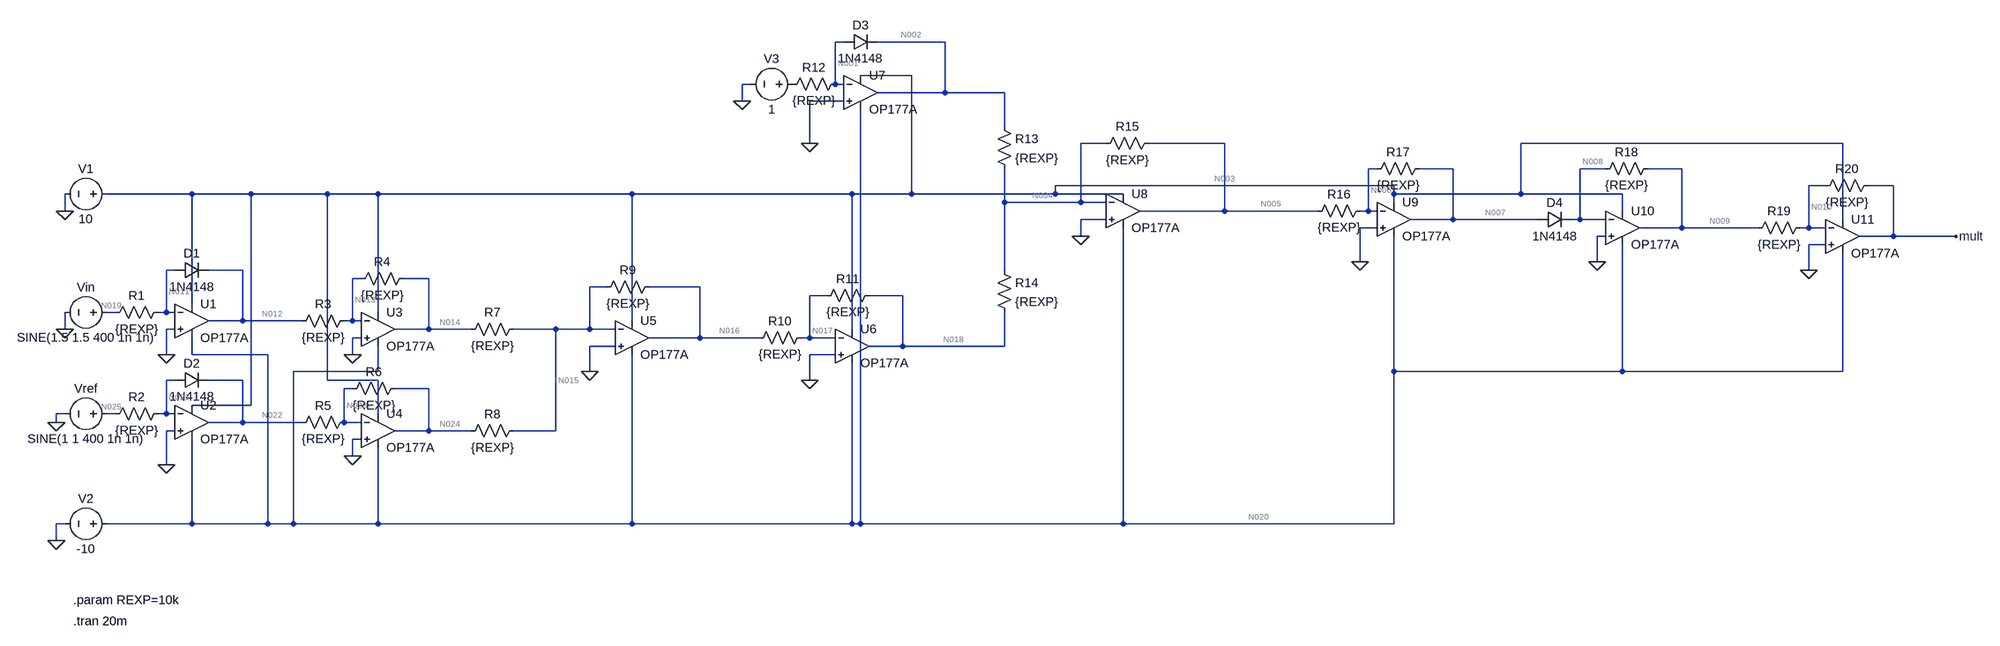
[diagram p0: schematic multiplier.asc]
multiplier.asc, the LTspice schematic file:
Version 4.1
SHEET 1 3688 712
WIRE 1504 -400 1488 -400
WIRE 1696 -400 1568 -400
WIRE 1632 -336 1536 -336
WIRE 1328 -320 1312 -320
WIRE 1488 -320 1488 -400
WIRE 1504 -320 1488 -320
WIRE 1696 -304 1696 -400
WIRE 1696 -304 1568 -304
WIRE 1808 -304 1696 -304
WIRE 1312 -288 1312 -320
WIRE 1504 -288 1440 -288
WIRE 1808 -240 1808 -304
WIRE 1440 -208 1440 -288
WIRE 2000 -208 1952 -208
WIRE 2224 -208 2080 -208
WIRE 3392 -208 2784 -208
WIRE 2512 -160 2496 -160
WIRE 2656 -160 2592 -160
WIRE 2944 -160 2896 -160
WIRE 3088 -160 3024 -160
WIRE 2544 -128 1904 -128
WIRE 3360 -128 3328 -128
WIRE 3488 -128 3440 -128
WIRE 272 -112 112 -112
WIRE 384 -112 272 -112
WIRE 528 -112 384 -112
WIRE 624 -112 528 -112
WIRE 1104 -112 624 -112
WIRE 1520 -112 1104 -112
WIRE 1632 -112 1632 -336
WIRE 1632 -112 1520 -112
WIRE 1904 -112 1904 -128
WIRE 1904 -112 1632 -112
WIRE 2032 -112 1904 -112
WIRE 2544 -112 2544 -128
WIRE 2784 -112 2784 -208
WIRE 2784 -112 2544 -112
WIRE 2976 -112 2784 -112
WIRE 1808 -96 1808 -160
WIRE 1952 -96 1952 -208
WIRE 1952 -96 1808 -96
WIRE 2000 -96 1952 -96
WIRE 2544 -96 2544 -112
WIRE 32 -80 32 -112
WIRE 2224 -80 2224 -208
WIRE 2224 -80 2064 -80
WIRE 2400 -80 2224 -80
WIRE 2496 -80 2496 -160
WIRE 2496 -80 2480 -80
WIRE 2512 -80 2496 -80
WIRE 2976 -80 2976 -112
WIRE 2000 -64 1952 -64
WIRE 2656 -64 2656 -160
WIRE 2656 -64 2576 -64
WIRE 2816 -64 2656 -64
WIRE 2896 -64 2896 -160
WIRE 2896 -64 2880 -64
WIRE 2944 -64 2896 -64
WIRE 3392 -64 3392 -208
WIRE 2512 -48 2480 -48
WIRE 3088 -48 3088 -160
WIRE 3088 -48 3008 -48
WIRE 3232 -48 3088 -48
WIRE 3328 -48 3328 -128
WIRE 3328 -48 3312 -48
WIRE 3360 -48 3328 -48
WIRE 1952 -32 1952 -64
WIRE 2944 -32 2928 -32
WIRE 3488 -32 3488 -128
WIRE 3488 -32 3424 -32
WIRE 3616 -32 3488 -32
WIRE 3360 -16 3328 -16
WIRE 2480 16 2480 -48
WIRE 2928 16 2928 -32
WIRE 240 32 224 32
WIRE 368 32 304 32
WIRE 1808 32 1808 -96
WIRE 3328 32 3328 -16
WIRE 592 48 576 48
WIRE 720 48 672 48
WIRE 1056 64 1024 64
WIRE 1232 64 1136 64
WIRE 1472 80 1440 80
WIRE 1616 80 1552 80
WIRE 272 96 272 -112
WIRE 128 112 112 112
WIRE 224 112 224 32
WIRE 224 112 208 112
WIRE 240 112 224 112
WIRE 624 112 624 -112
WIRE 368 128 368 32
WIRE 368 128 304 128
WIRE 480 128 368 128
WIRE 576 128 576 48
WIRE 576 128 560 128
WIRE 592 128 576 128
WIRE 1104 128 1104 -112
WIRE 32 144 32 112
WIRE 240 144 224 144
WIRE 720 144 720 48
WIRE 720 144 656 144
WIRE 800 144 720 144
WIRE 960 144 880 144
WIRE 1024 144 1024 64
WIRE 1024 144 960 144
WIRE 1072 144 1024 144
WIRE 1520 144 1520 -112
WIRE 592 160 576 160
WIRE 1232 160 1232 64
WIRE 1232 160 1136 160
WIRE 1344 160 1232 160
WIRE 1440 160 1440 80
WIRE 1440 160 1424 160
WIRE 1488 160 1440 160
WIRE 1072 176 1024 176
WIRE 1616 176 1616 80
WIRE 1616 176 1552 176
WIRE 1808 176 1808 112
WIRE 1808 176 1616 176
WIRE 224 192 224 144
WIRE 272 192 272 160
WIRE 416 192 272 192
WIRE 576 192 576 160
WIRE 1488 192 1440 192
WIRE 624 224 624 176
WIRE 624 224 464 224
WIRE 1024 224 1024 176
WIRE 2544 224 2544 -32
WIRE 2976 224 2976 -16
WIRE 2976 224 2544 224
WIRE 3392 224 3392 0
WIRE 3392 224 2976 224
WIRE 240 240 224 240
WIRE 368 240 304 240
WIRE 528 240 528 -112
WIRE 624 240 528 240
WIRE 1440 240 1440 192
WIRE 576 256 560 256
WIRE 720 256 656 256
WIRE 384 288 384 -112
WIRE 384 288 272 288
WIRE 32 304 16 304
WIRE 128 304 112 304
WIRE 224 304 224 240
WIRE 224 304 208 304
WIRE 240 304 224 304
WIRE 624 304 624 240
WIRE 16 320 16 304
WIRE 368 320 368 240
WIRE 368 320 304 320
WIRE 480 320 368 320
WIRE 560 320 560 256
WIRE 592 320 560 320
WIRE 240 336 224 336
WIRE 720 336 720 256
WIRE 720 336 656 336
WIRE 800 336 720 336
WIRE 960 336 960 144
WIRE 960 336 880 336
WIRE 592 352 576 352
WIRE 576 384 576 352
WIRE 224 400 224 336
WIRE 32 512 16 512
WIRE 272 512 272 352
WIRE 272 512 112 512
WIRE 416 512 416 192
WIRE 416 512 272 512
WIRE 464 512 464 224
WIRE 464 512 416 512
WIRE 624 512 624 368
WIRE 624 512 464 512
WIRE 1104 512 1104 192
WIRE 1104 512 624 512
WIRE 1520 512 1520 208
WIRE 1520 512 1104 512
WIRE 1536 512 1536 -272
WIRE 1536 512 1520 512
WIRE 2032 512 2032 -48
WIRE 2032 512 1536 512
WIRE 2544 512 2544 224
WIRE 2544 512 2032 512
WIRE 16 544 16 512
FLAG 32 144 0
FLAG 224 192 0
FLAG 16 320 0
FLAG 224 400 0
FLAG 576 192 0
FLAG 576 384 0
FLAG 32 -80 0
FLAG 16 544 0
FLAG 1024 224 0
FLAG 1440 240 0
FLAG 1312 -288 0
FLAG 1440 -208 0
FLAG 1952 -32 0
FLAG 2480 16 0
FLAG 2928 16 0
FLAG 3328 32 0
FLAG 3616 -32 mult
SYMBOL voltage 128 112 R90
WINDOW 0 -32 56 VBottom 2
WINDOW 3 32 56 VTop 2
WINDOW 123 0 0 Left 0
WINDOW 39 0 0 Left 0
SYMATTR InstName Vin
SYMATTR Value SINE(1.5 1.5 400 1n 1n)
SYMBOL OpAmps\\OP177A 272 64 R0
SYMATTR InstName U1
SYMBOL res 224 96 R90
WINDOW 0 0 56 VBottom 2
WINDOW 3 32 56 VTop 2
SYMATTR InstName R1
SYMATTR Value {REXP}
SYMBOL diode 240 48 R270
WINDOW 0 32 32 VTop 2
WINDOW 3 0 32 VBottom 2
SYMATTR InstName D1
SYMATTR Value 1N4148
SYMBOL OpAmps\\OP177A 272 256 R0
SYMATTR InstName U2
SYMBOL voltage 128 304 R90
WINDOW 0 -32 56 VBottom 2
WINDOW 3 32 56 VTop 2
WINDOW 123 0 0 Left 0
WINDOW 39 0 0 Left 0
SYMATTR InstName Vref
SYMATTR Value SINE(1 1 400 1n 1n)
SYMBOL res 224 288 R90
WINDOW 0 0 56 VBottom 2
WINDOW 3 32 56 VTop 2
SYMATTR InstName R2
SYMATTR Value {REXP}
SYMBOL diode 240 256 R270
WINDOW 0 32 32 VTop 2
WINDOW 3 0 32 VBottom 2
SYMATTR InstName D2
SYMATTR Value 1N4148
SYMBOL OpAmps\\OP177A 624 80 R0
SYMATTR InstName U3
SYMBOL res 576 112 R90
WINDOW 0 0 56 VBottom 2
WINDOW 3 32 56 VTop 2
SYMATTR InstName R3
SYMATTR Value {REXP}
SYMBOL res 688 32 R90
WINDOW 0 0 56 VBottom 2
WINDOW 3 32 56 VTop 2
SYMATTR InstName R4
SYMATTR Value {REXP}
SYMBOL OpAmps\\OP177A 624 272 R0
SYMATTR InstName U4
SYMBOL res 576 304 R90
WINDOW 0 0 56 VBottom 2
WINDOW 3 32 56 VTop 2
SYMATTR InstName R5
SYMATTR Value {REXP}
SYMBOL res 672 240 R90
WINDOW 0 0 56 VBottom 2
WINDOW 3 32 56 VTop 2
SYMATTR InstName R6
SYMATTR Value {REXP}
SYMBOL voltage 128 -112 R90
WINDOW 0 -32 56 VBottom 2
WINDOW 3 32 56 VTop 2
WINDOW 123 0 0 Left 0
WINDOW 39 0 0 Left 0
SYMATTR InstName V1
SYMATTR Value 10
SYMBOL voltage 128 512 R90
WINDOW 0 -32 56 VBottom 2
WINDOW 3 32 56 VTop 2
WINDOW 123 0 0 Left 0
WINDOW 39 0 0 Left 0
SYMATTR InstName V2
SYMATTR Value -10
SYMBOL res 896 128 R90
WINDOW 0 0 56 VBottom 2
WINDOW 3 32 56 VTop 2
SYMATTR InstName R7
SYMATTR Value {REXP}
SYMBOL res 896 320 R90
WINDOW 0 0 56 VBottom 2
WINDOW 3 32 56 VTop 2
SYMATTR InstName R8
SYMATTR Value {REXP}
SYMBOL OpAmps\\OP177A 1104 96 R0
SYMATTR InstName U5
SYMBOL res 1152 48 R90
WINDOW 0 0 56 VBottom 2
WINDOW 3 32 56 VTop 2
SYMATTR InstName R9
SYMATTR Value {REXP}
SYMBOL res 1440 144 R90
WINDOW 0 0 56 VBottom 2
WINDOW 3 32 56 VTop 2
SYMATTR InstName R10
SYMATTR Value {REXP}
SYMBOL OpAmps\\OP177A 1520 112 R0
SYMATTR InstName U6
SYMBOL res 1568 64 R90
WINDOW 0 0 56 VBottom 2
WINDOW 3 32 56 VTop 2
SYMATTR InstName R11
SYMATTR Value {REXP}
SYMBOL OpAmps\\OP177A 1536 -368 R0
SYMATTR InstName U7
SYMBOL voltage 1424 -320 R90
WINDOW 0 -32 56 VBottom 2
WINDOW 3 32 56 VTop 2
WINDOW 123 0 0 Left 0
WINDOW 39 0 0 Left 0
SYMATTR InstName V3
SYMATTR Value 1
SYMBOL res 1504 -336 R90
WINDOW 0 0 56 VBottom 2
WINDOW 3 32 56 VTop 2
SYMATTR InstName R12
SYMATTR Value {REXP}
SYMBOL diode 1504 -384 R270
WINDOW 0 32 32 VTop 2
WINDOW 3 0 32 VBottom 2
SYMATTR InstName D3
SYMATTR Value 1N4148
SYMBOL OpAmps\\OP177A 2032 -144 R0
SYMATTR InstName U8
SYMBOL res 1792 -256 R0
SYMATTR InstName R13
SYMATTR Value {REXP}
SYMBOL res 1792 16 R0
SYMATTR InstName R14
SYMATTR Value {REXP}
SYMBOL res 2096 -224 R90
WINDOW 0 0 56 VBottom 2
WINDOW 3 32 56 VTop 2
SYMATTR InstName R15
SYMATTR Value {REXP}
SYMBOL OpAmps\\OP177A 2544 -128 R0
SYMATTR InstName U9
SYMBOL res 2496 -96 R90
WINDOW 0 0 56 VBottom 2
WINDOW 3 32 56 VTop 2
SYMATTR InstName R16
SYMATTR Value {REXP}
SYMBOL res 2608 -176 R90
WINDOW 0 0 56 VBottom 2
WINDOW 3 32 56 VTop 2
SYMATTR InstName R17
SYMATTR Value {REXP}
SYMBOL OpAmps\\OP177A 2976 -112 R0
SYMATTR InstName U10
SYMBOL diode 2816 -48 R270
WINDOW 0 32 32 VTop 2
WINDOW 3 0 32 VBottom 2
SYMATTR InstName D4
SYMATTR Value 1N4148
SYMBOL res 3040 -176 R90
WINDOW 0 0 56 VBottom 2
WINDOW 3 32 56 VTop 2
SYMATTR InstName R18
SYMATTR Value {REXP}
SYMBOL OpAmps\\OP177A 3392 -96 R0
SYMATTR InstName U11
SYMBOL res 3328 -64 R90
WINDOW 0 0 56 VBottom 2
WINDOW 3 32 56 VTop 2
SYMATTR InstName R19
SYMATTR Value {REXP}
SYMBOL res 3456 -144 R90
WINDOW 0 0 56 VBottom 2
WINDOW 3 32 56 VTop 2
SYMATTR InstName R20
SYMATTR Value {REXP}
TEXT 48 656 Left 2 !.param REXP=10k
TEXT 48 696 Left 2 !.tran 20m

The netlist it stands for:
* multiplier.asc
Vin N019 0 SINE(1.5 1.5 400 1n 1n)
X§U1 0 N011 N003 N020 N012 OP177A  ; pins In+ In- V+ V- OUT
R1 N011 N019 {REXP}
D1 N011 N012 1N4148
X§U2 0 N021 N003 N020 N022 OP177A  ; pins In+ In- V+ V- OUT
Vref N025 0 SINE(1 1 400 1n 1n)
R2 N021 N025 {REXP}
D2 N021 N022 1N4148
X§U3 0 N013 N003 N020 N014 OP177A  ; pins In+ In- V+ V- OUT
R3 N013 N012 {REXP}
R4 N014 N013 {REXP}
X§U4 0 N023 N003 N020 N024 OP177A  ; pins In+ In- V+ V- OUT
R5 N023 N022 {REXP}
R6 N024 N023 {REXP}
V1 N003 0 10
V2 N020 0 -10
R7 N015 N014 {REXP}
R8 N015 N024 {REXP}
X§U5 0 N015 N003 N020 N016 OP177A  ; pins In+ In- V+ V- OUT
R9 N016 N015 {REXP}
R10 N017 N016 {REXP}
X§U6 0 N017 N003 N020 N018 OP177A  ; pins In+ In- V+ V- OUT
R11 N018 N017 {REXP}
X§U7 0 N001 N003 N020 N002 OP177A  ; pins In+ In- V+ V- OUT
V3 P001 0 1
R12 N001 P001 {REXP}
D3 N001 N002 1N4148
X§U8 0 N004 N003 N020 N005 OP177A  ; pins In+ In- V+ V- OUT
R13 N002 N004 {REXP}
R14 N004 N018 {REXP}
R15 N005 N004 {REXP}
X§U9 0 N006 N003 N020 N007 OP177A  ; pins In+ In- V+ V- OUT
R16 N006 N005 {REXP}
R17 N007 N006 {REXP}
X§U10 0 N008 N003 N020 N009 OP177A  ; pins In+ In- V+ V- OUT
D4 N007 N008 1N4148
R18 N009 N008 {REXP}
X§U11 0 N010 N003 N020 mult OP177A  ; pins In+ In- V+ V- OUT
R19 N010 N009 {REXP}
R20 mult N010 {REXP}
.model D D
.lib standard.dio
.param REXP=10k
.tran 20m
.backanno
.end

* Results of the author's LTspice run, read from the files saved beside the schematic
* Operating Point, zero values left out:
*   V(mult) = 1.501 V
*   V(n001) = 25.09 µV
*   V(n002) = -479.9 mV
*   V(n003) = 10 V
*   V(n004) = 25.1 µV
*   V(n005) = -498.3 mV
*   V(n006) = 24.85 µV
*   V(n007) = 498.3 mV
*   V(n008) = 25.34 µV
*   V(n009) = -1.5 V
*   V(n010) = 24.62 µV
*   V(n011) = 25.1 µV
*   V(n012) = -498.3 mV
*   V(n013) = 24.86 µV
*   V(n014) = 498.3 mV
*   V(n015) = 25.21 µV
*   V(n016) = -978.2 mV
*   V(n017) = 24.74 µV
*   V(n018) = 978.2 mV
*   V(n019) = 1.5 V
*   V(n020) = -10 V
*   V(n021) = 25.09 µV
*   V(n022) = -479.9 mV
*   V(n023) = 24.86 µV
*   V(n024) = 479.9 mV
*   V(n025) = 1 V
*   V(p001) = 1 V
*   I(D1) = 150 µA
*   I(D2) = 100 µA
*   I(D3) = 100 µA
*   I(D4) = 150.1 µA
*   I(R1) = -150 µA
*   I(R10) = 97.82 µA
*   I(R11) = 97.82 µA
*   I(R12) = -100 µA
*   I(R13) = -47.99 µA
*   I(R14) = -97.82 µA
*   I(R15) = -49.83 µA
*   I(R16) = 49.83 µA
*   I(R17) = 49.83 µA
*   I(R18) = -150 µA
*   I(R19) = 150 µA
*   I(R2) = -100 µA
*   I(R20) = 150.1 µA
*   I(R3) = 49.83 µA
*   I(R4) = 49.83 µA
*   I(R5) = 47.99 µA
*   I(R6) = 47.99 µA
*   I(R7) = -49.83 µA
*   I(R8) = -47.99 µA
*   I(R9) = -97.82 µA
*   I(V1) = -16.98 mA
*   I(V2) = 16.98 mA
*   I(V3) = -100 µA
*   I(Vin) = -150 µA
*   I(Vref) = -100 µA
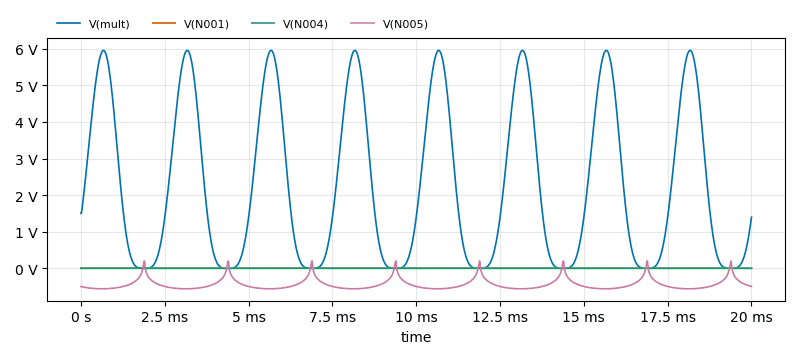
[diagram p1: Transient Analysis of multiplier.asc, plotted from the saved traces]
* Transient Analysis, 1 run:
*   V(mult): min -215.1 µV, max 5.957 V, average 2.245 V, rms 3.126 V, last 1.396 V
*   V(N001): min 24.21 µV, max 26.3 µV, average 25.09 µV, rms 25.09 µV, last 25.09 µV
*   V(N004): min -1.669 mV, max 3.148 mV, average 25.08 µV, rms 400.6 µV, last 94.02 µV
*   V(N005): min -561.2 mV, max 200.6 mV, average -437.2 mV, rms 464 mV, last -497.5 mV